# Altium schematic sheet NOR_FLASH.SchDoc
size A; SheetNumber: 9; SheetTotal: 10
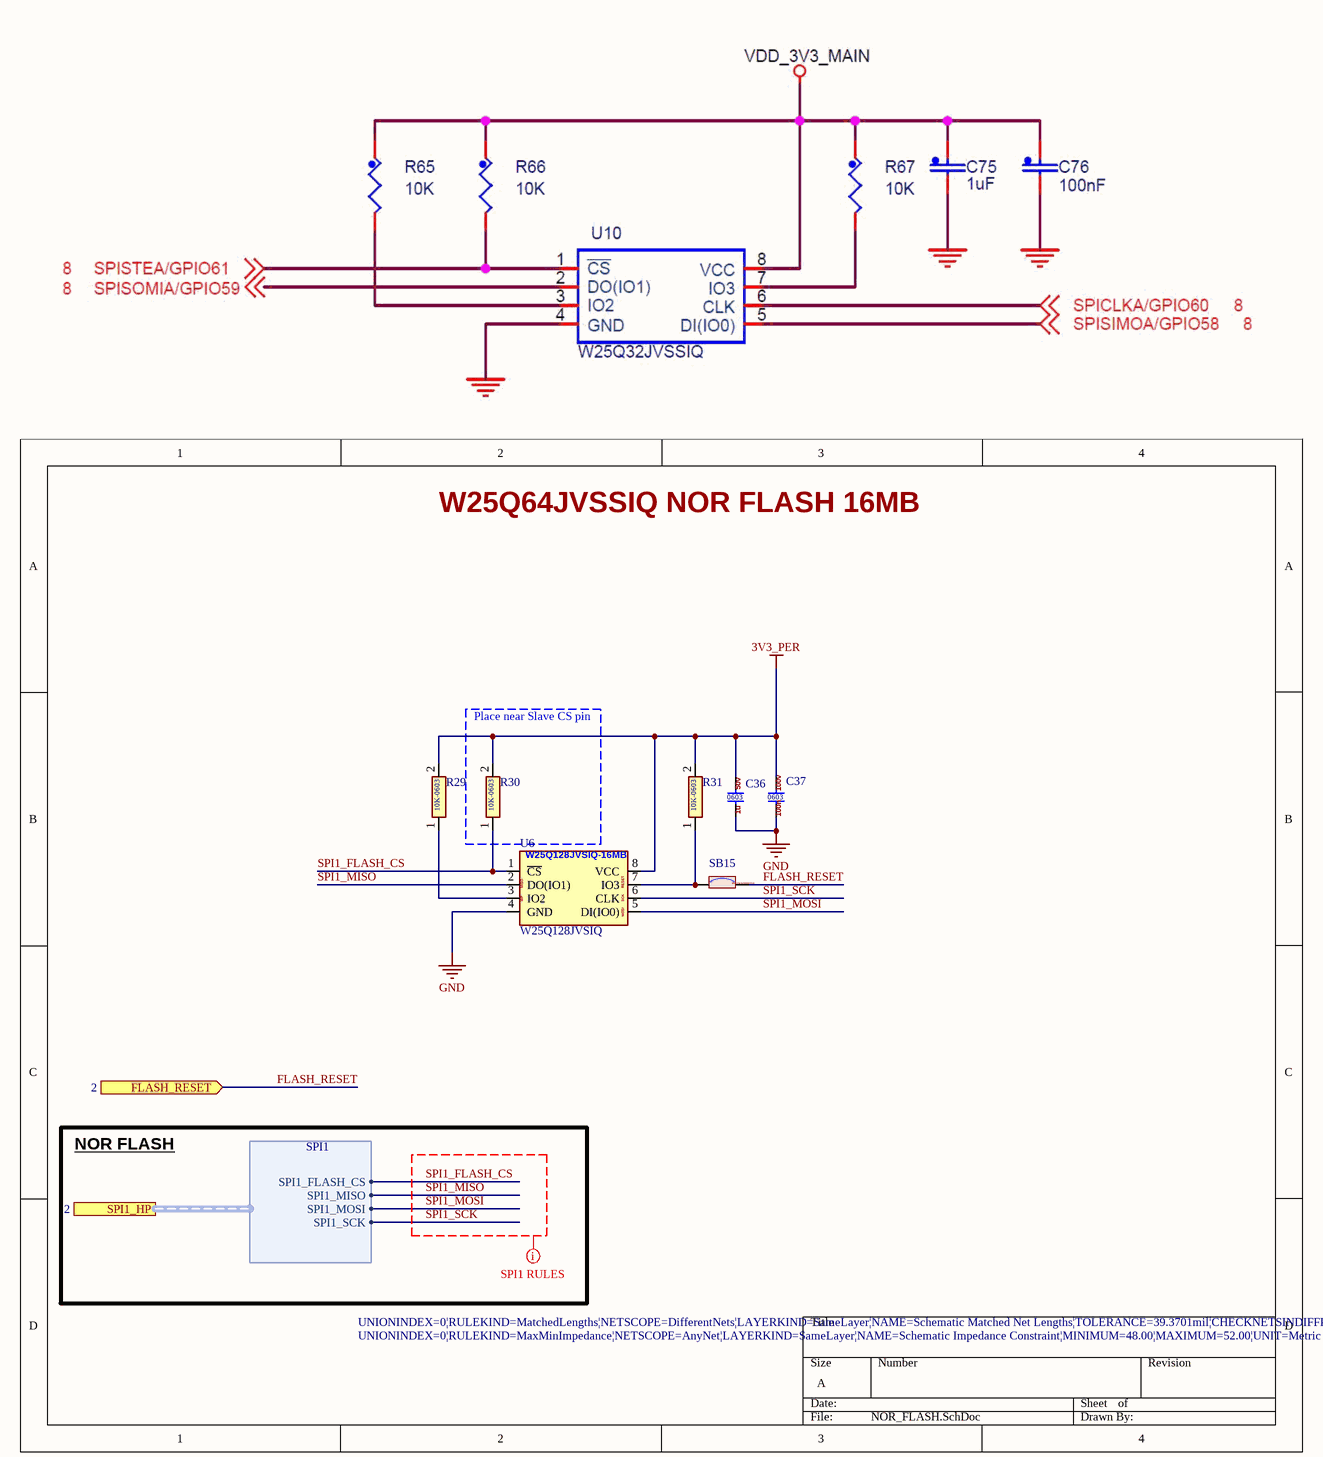
[diagram p0: NOR_FLASH.SchDoc]

## Parts
C36  CL10A105KB8NNNC  [0603-CAP]  (value not drawn)
C37  CL10B104KC8NNNC  [0603-CAP]  (value not drawn)
R29  0603WAF1002T5E  [0603-RES]  (value not drawn)
R30  0603WAF1002T5E  [0603-RES]  (value not drawn)
R31  0603WAF1002T5E  [0603-RES]  (value not drawn)
SB15  0603WAF0000T5E  [SOLDER-BRIDGE_R0603-0R]  (value not drawn)
U6  W25Q128JVSIQ  [SOIC-8N]

## Blocks framed on the sheet
Place near Slave CS pin: R30

## Ports
FLASH_RESET (in, see 2), SPI1_HP (harness SPI1, see 2)

## Harnesses
SPI1: SPI1_FLASH_CS, SPI1_MISO, SPI1_MOSI, SPI1_SCK

## Nets
3V3_PER: C36.2 C37.2 R29.2 R30.2 R31.2 U6.8(VCC)
GND: C36.1 C37.1 U6.4(GND)
FLASH_RESET: SB15.1 ; port FLASH_RESET
SPI1_FLASH_CS: R30.1 U6.1(~{CS}) ; port SPI1_HP.SPI1_FLASH_CS
SPI1_MISO: U6.2(DO(IO1)) ; port SPI1_HP.SPI1_MISO
SPI1_MOSI: U6.5(DI(IO0)) ; port SPI1_HP.SPI1_MOSI
SPI1_SCK: U6.6(CLK) ; port SPI1_HP.SPI1_SCK
NetR29_1: R29.1 U6.3(IO2)
NetR31_1: R31.1 SB15.2 U6.7(IO3)

## Layout directives
rule Matched Net Lengths [Tolerance = 1mm]; rule Impedance Constraint [Min = 48.00    Max = 52.00    ]; net class SPI1_CLASS: SPI1_FLASH_CS, SPI1_MISO, SPI1_MOSI, SPI1_SCK

## Notes on the sheet
- W25Q64JVSSIQ NOR FLASH 16MB
- NOR FLASH
- (in symbol 0603WAF1002T5E) 10K-0603
- (in symbol CL10A105KB8NNNC) 50v; 0603; 1u
- (in symbol CL10B104KC8NNNC) 100v; 0603; 100n
- (in symbol W25Q128JVSIQ) W25Q128JVSIQ-16MB; MISO; RESET; WP; SCK; MOSI

## Library data of the parts
C36 = CL10A105KB8NNNC: CAP: CER 1UF 50V X5R 0603; LCSC Part #: C15849; Unit Price: 0.0026
C37 = CL10B104KC8NNNC: CAP: CER 100NF 100V X7R 0603; POC Price: 0.006; LCSC Part #: C15725; Unit Price: 0.0036; ComponentLink1Description: DS; ComponentLink1URL: https://www.lcsc.com/datasheet/C15725.pdf
R29-R31 = 0603WAF1002T5E: RES: 10K OHM 1% 100mW 0603 75V; LCSC Part #: C25804; Unit Price: 0.0005; ComponentLink1Description: DS; ComponentLink1URL: https://www.lcsc.com/datasheet/C25804.pdf
SB15 = 0603WAF0000T5E: Solder Bridge: ON SB 0603; LCSC Part #: C21189; Unit Price: 0.0006; ComponentLink1Description: DS; ComponentLink1URL: https://www.lcsc.com/datasheet/C21189.pdf
U6 = W25Q128JVSIQ: Flash: 128Mbit SPI 133MHz SOIC-8-208mil NOR FLASH ROHS; POC Price: 1.2147; LCSC Part #: C97521; Unit Price: 0.8016; ComponentLink1Description: DS; ComponentLink1URL: https://www.lcsc.com/datasheet/C97521.pdf